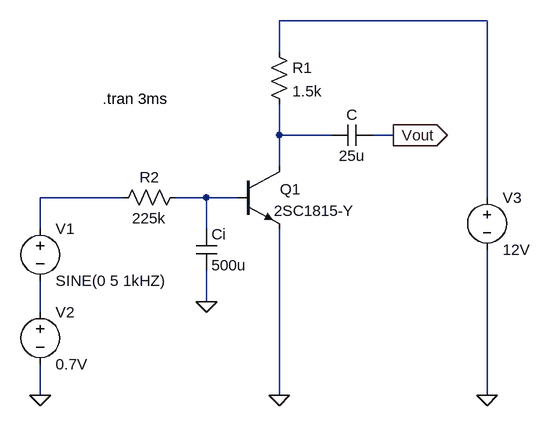
[diagram p0: schematic jikken1.asc]
jikken1.asc, the LTspice schematic file:
Version 4
SHEET 1 880 680
WIRE 592 -80 272 -80
WIRE 272 -32 272 -80
WIRE 272 96 272 48
WIRE 352 96 272 96
WIRE 448 96 416 96
WIRE 272 144 272 96
WIRE 32 192 -96 192
WIRE 160 192 112 192
WIRE 208 192 160 192
WIRE 592 192 592 -80
WIRE -96 240 -96 192
WIRE 160 240 160 192
WIRE 160 352 160 304
WIRE -96 368 -96 320
WIRE -96 496 -96 448
WIRE 272 496 272 240
WIRE 592 496 592 272
FLAG -96 496 0
FLAG 272 496 0
FLAG 592 496 0
FLAG 448 96 Vout
IOPIN 448 96 Out
FLAG 160 352 0
SYMBOL npn 208 144 R0
WINDOW 0 65 35 Left 2
SYMATTR InstName Q1
SYMATTR Value 2SC1815-Y
SYMBOL res 256 -48 R0
SYMATTR InstName R1
SYMATTR Value 1.5k
SYMBOL res 128 176 R90
WINDOW 0 0 56 VBottom 2
WINDOW 3 32 56 VTop 2
SYMATTR InstName R2
SYMATTR Value 225k
SYMBOL voltage -96 224 R0
WINDOW 123 0 0 Left 0
WINDOW 39 0 0 Left 0
SYMATTR InstName V1
SYMATTR Value SINE(0 5 1kHZ)
SYMBOL voltage -96 352 R0
SYMATTR InstName V2
SYMATTR Value 0.7V
SYMBOL voltage 592 176 R0
SYMATTR InstName V3
SYMATTR Value 12V
SYMBOL cap 416 80 R90
WINDOW 0 0 32 VBottom 2
WINDOW 3 32 32 VTop 2
SYMATTR InstName C
SYMATTR Value 25u
SYMBOL cap 144 240 R0
SYMATTR InstName Ci
SYMATTR Value 500u
TEXT 0 40 Left 2 !.tran 3ms

The netlist it stands for:
* jikken1.asc
Q1 N002 N004 0 0 2SC1815-Y
R1 N001 N002 1.5k
R2 N004 N003 225k
V1 N003 N005 SINE(0 5 1kHZ)
V2 N005 0 0.7V
V3 N001 0 12V
C Vout N002 25u
Ci N004 0 500u
.model NPN NPN
.model PNP PNP
.lib standard.bjt
.tran 3ms
.backanno
.end